# Altium schematic sheet ledbrick.SchDoc
size A
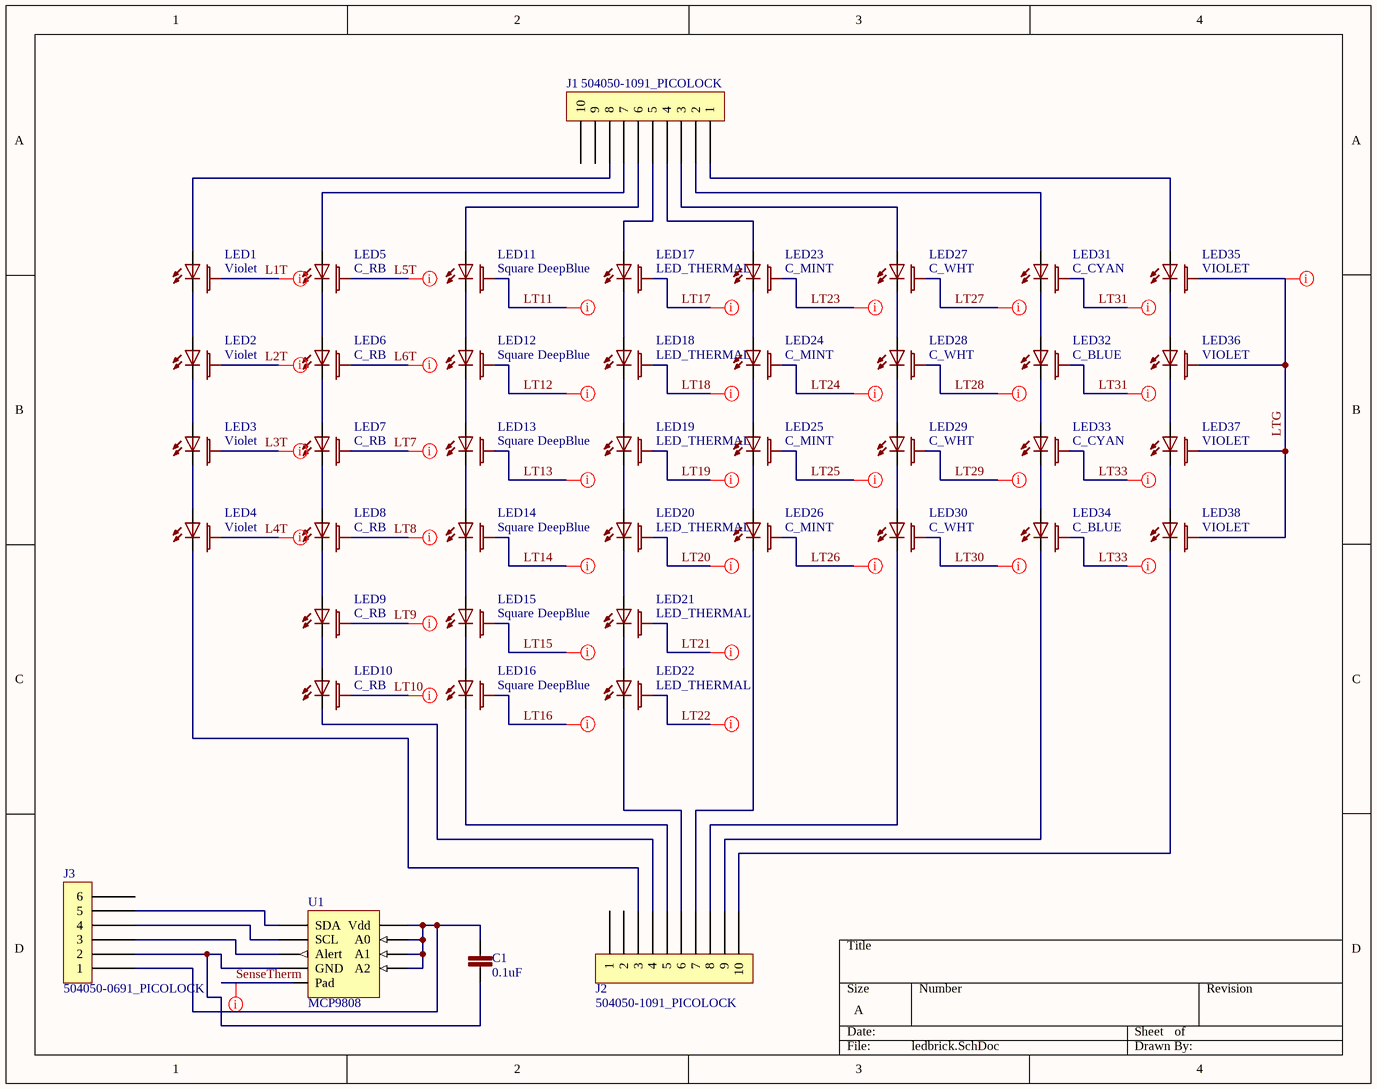
[diagram p0: ledbrick.SchDoc]

## Parts
C1  0.1uF  [C0603]
J1  504050-1091_PICOLOCK  [504050-1091_PICOLOCK]
J2  504050-1091_PICOLOCK  [504050-1091_PICOLOCK]
J3  504050-0691_PICOLOCK  [504050-0691_PICOLOCK]
LED1  Violet  [SEMILED_3535]
LED2  Violet  [SEMILED_3535]
LED3  Violet  [SEMILED_3535]
LED4  Violet  [SEMILED_3535]
LED5  C_RB  [LUXEON_C]
LED6  C_RB  [LUXEON_C]
LED7  C_RB  [LUXEON_C]
LED8  C_RB  [LUXEON_C]
LED9  C_RB  [LUXEON_C]
LED10  C_RB  [LUXEON_C]
LED11  Square DeepBlue  [OSRAM_OSLON_SQUARE]
LED12  Square DeepBlue  [OSRAM_OSLON_SQUARE]
LED13  Square DeepBlue  [OSRAM_OSLON_SQUARE]
LED14  Square DeepBlue  [OSRAM_OSLON_SQUARE]
LED15  Square DeepBlue  [OSRAM_OSLON_SQUARE]
LED16  Square DeepBlue  [OSRAM_OSLON_SQUARE]
LED17  LED_THERMAL  [LUXEON_C]
LED18  LED_THERMAL  [LUXEON_C]
LED19  LED_THERMAL  [LUXEON_C]
LED20  LED_THERMAL  [LUXEON_C]
LED21  LED_THERMAL  [LUXEON_C]
LED22  LED_THERMAL  [LUXEON_C]
LED23  C_MINT  [LUXEON_C]
LED24  C_MINT  [LUXEON_C]
LED25  C_MINT  [LUXEON_C]
LED26  C_MINT  [LUXEON_C]
LED27  C_WHT  [LUXEON_C]
LED28  C_WHT  [LUXEON_C]
LED29  C_WHT  [LUXEON_C]
LED30  C_WHT  [LUXEON_C]
LED31  C_CYAN  [LUXEON_C]
LED32  C_BLUE  [LUXEON_C]
LED33  C_CYAN  [LUXEON_C]
LED34  C_BLUE  [LUXEON_C]
LED35  VIOLET  [SEMILED_3535]
LED36  VIOLET  [SEMILED_3535]
LED37  VIOLET  [SEMILED_3535]
LED38  VIOLET  [SEMILED_3535]
U1  MCP9808  [DFN8]

## Nets
L1T: LED1.PAD
L2T: LED2.PAD
L3T: LED3.PAD
L4T: LED4.PAD
L5T: LED5.PAD
L6T: LED6.PAD
LT7: LED7.PAD
LT8: LED8.PAD
LT9: LED9.PAD
LT10: LED10.PAD
LT11: LED11.PAD
LT12: LED12.PAD
LT13: LED13.PAD
LT14: LED14.PAD
LT15: LED15.PAD
LT16: LED16.PAD
LT17: LED17.PAD
LT18: LED18.PAD
LT19: LED19.PAD
LT20: LED20.PAD
LT21: LED21.PAD
LT22: LED22.PAD
LT23: LED23.PAD
LT24: LED24.PAD
LT25: LED25.PAD
LT26: LED26.PAD
LT27: LED27.PAD
LT28: LED28.PAD
LT29: LED29.PAD
LT30: LED30.PAD
LT31: LED31.PAD LED32.PAD
LT33: LED33.PAD LED34.PAD
LTG: LED35.PAD LED36.PAD LED37.PAD LED38.PAD
SenseTherm: U1.PAD(Pad)
NetC1_1: C1.1 J3.1 U1.5(A2) U1.6(A1) U1.7(A0) U1.8(Vdd)
NetC1_2: C1.2 J3.2 U1.4(GND)
NetJ1_1: J1.1 LED35.A
NetJ1_2: J1.2 LED31.A
NetJ1_3: J1.3 LED27.A
NetJ1_4: J1.4 LED23.A
NetJ1_5: J1.5 LED17.A
NetJ1_6: J1.6 LED11.A
NetJ1_7: J1.7 LED5.A
NetJ1_8: J1.8 LED1.A
NetJ2_3: J2.3 LED4.C
NetJ2_4: J2.4 LED10.C
NetJ2_5: J2.5 LED16.C
NetJ2_6: J2.6 LED22.C
NetJ2_7: J2.7 LED26.C
NetJ2_8: J2.8 LED30.C
NetJ2_9: J2.9 LED34.C
NetJ2_10: J2.10 LED38.C
NetJ3_3: J3.3 U1.3(Alert)
NetJ3_4: J3.4 U1.2(SCL)
NetJ3_5: J3.5 U1.1(SDA)
NetLED1_C: LED1.C LED2.A
NetLED2_C: LED2.C LED3.A
NetLED3_C: LED3.C LED4.A
NetLED5_C: LED5.C LED6.A
NetLED6_C: LED6.C LED7.A
NetLED7_C: LED7.C LED8.A
NetLED8_C: LED8.C LED9.A
NetLED9_C: LED9.C LED10.A
NetLED11_C: LED11.C LED12.A
NetLED12_C: LED12.C LED13.A
NetLED13_C: LED13.C LED14.A
NetLED14_C: LED14.C LED15.A
NetLED15_C: LED15.C LED16.A
NetLED17_C: LED17.C LED18.A
NetLED18_C: LED18.C LED19.A
NetLED19_C: LED19.C LED20.A
NetLED20_C: LED20.C LED21.A
NetLED21_C: LED21.C LED22.A
NetLED23_C: LED23.C LED24.A
NetLED24_C: LED24.C LED25.A
NetLED25_C: LED25.C LED26.A
NetLED27_C: LED27.C LED28.A
NetLED28_C: LED28.C LED29.A
NetLED29_C: LED29.C LED30.A
NetLED31_C: LED31.C LED32.A
NetLED32_C: LED32.C LED33.A
NetLED33_C: LED33.C LED34.A
NetLED35_C: LED35.C LED36.A
NetLED36_C: LED36.C LED37.A
NetLED37_C: LED37.C LED38.A

Not connected (* = marked no-connect by the designer): J1 9 10; J2 1 2; J3 6

## Layout directives
net class Thermal: L1T, L2T, L3T, L4T, L5T, L6T, LT7, LT8, LT9, LT10, LT11, LT12, LT13, LT14, LT15, LT16, LT17, LT18, LT19, LT20, LT21, LT22, LT23, LT24, LT25, LT26, LT27, LT28, LT29, LT30, LT31, LT33, LTG, SenseTherm

## Library data of the parts
C1 = C-EU
LED1-LED16 LED23-LED38 = LED_THERMAL